# EAGLE design DreamPicoPortSchem (EAGLE 9.7.0)
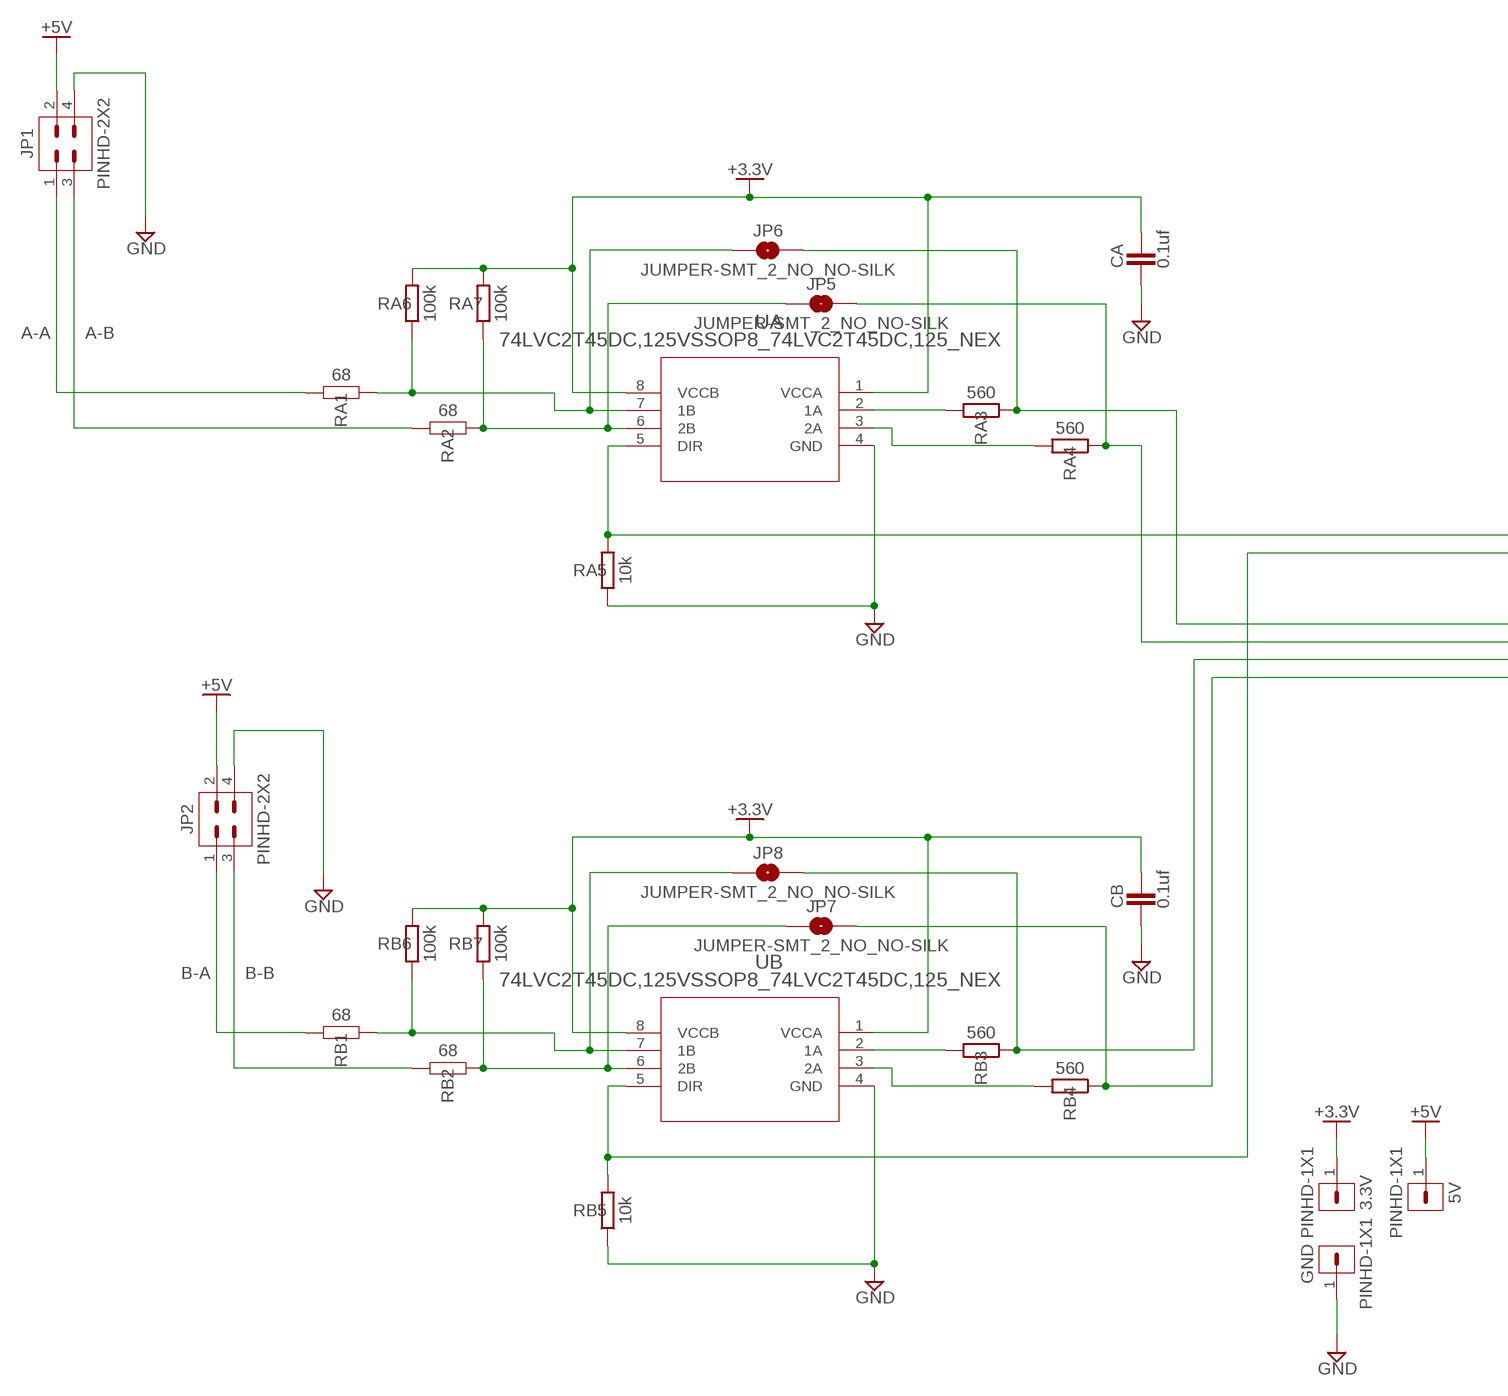
[diagram p0: schematic, sheet 1, part 1 of 2]
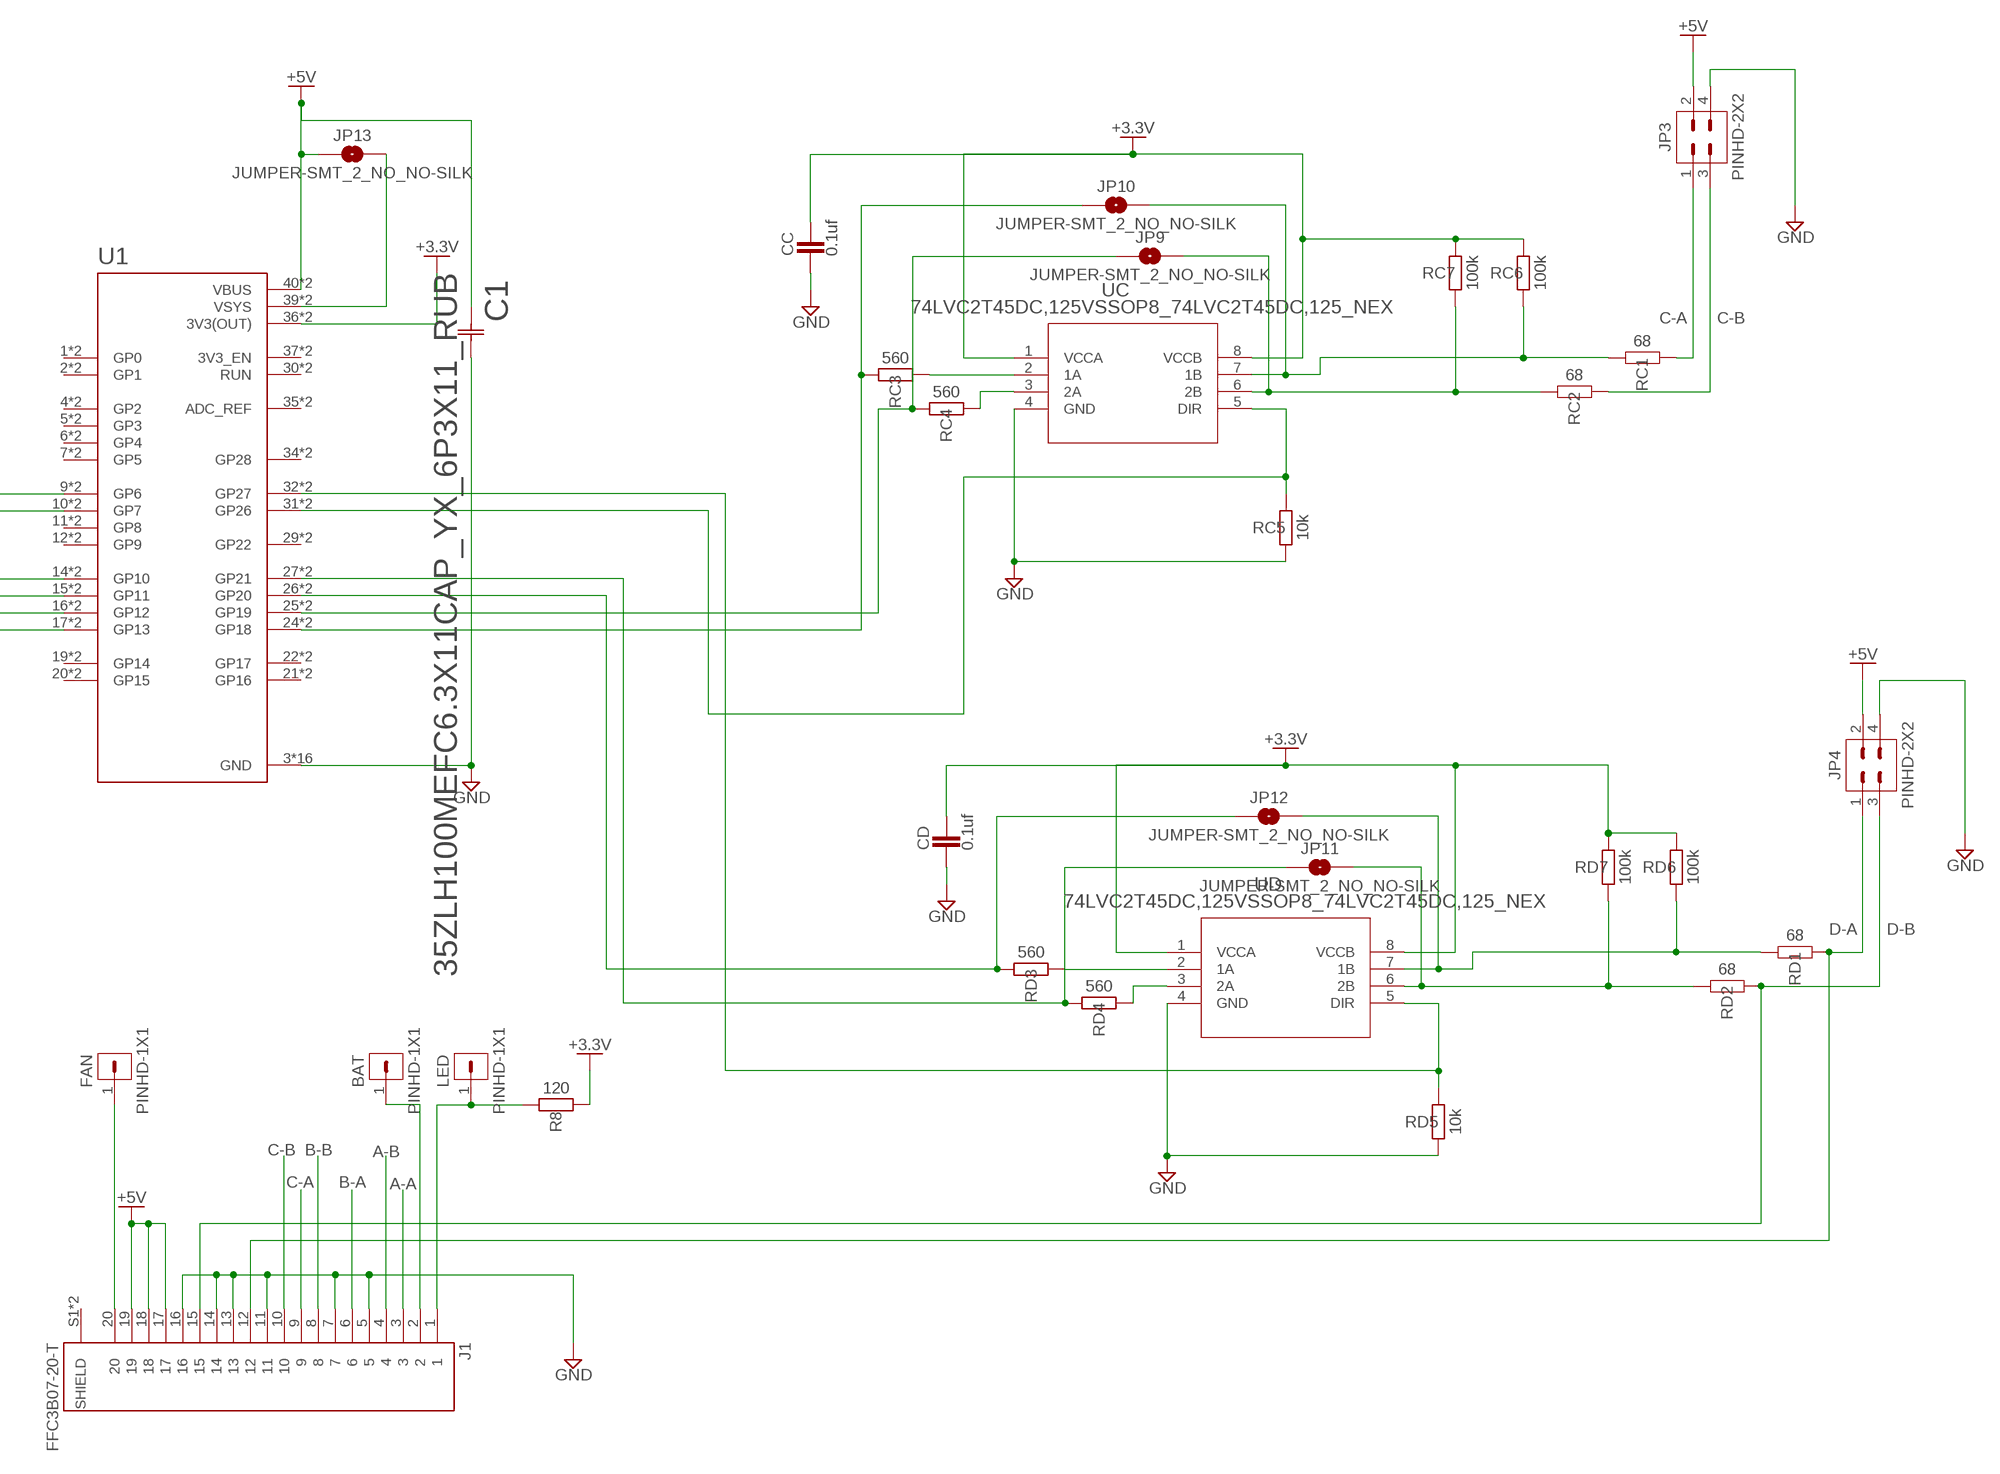
[diagram p1: schematic, sheet 1, part 2 of 2]

## Parts
3.3V  PINHD-1X1  [1X01]
5V  PINHD-1X1  [1X01]
BAT  PINHD-1X1  [1X01]
C1  35ZLH100MEFC6.3X11CAP_YX_6P3X11_RUB  [CAP_YX_6P3X11_RUB]
CA  0.1uf  CAPACITOR_CHIP-0603(1608-METRIC)  [CAPC1608X85]
CB  0.1uf  CAPACITOR_CHIP-0603(1608-METRIC)  [CAPC1608X85]
CC  0.1uf  CAPACITOR_CHIP-0603(1608-METRIC)  [CAPC1608X85]
CD  0.1uf  CAPACITOR_CHIP-0603(1608-METRIC)  [CAPC1608X85]
FAN  PINHD-1X1  [1X01]
GND  PINHD-1X1  [1X01]
J1  FFC3B07-20-T  [GCT_FFC3B07-20-T]
JP1  PINHD-2X2  [2X02]
JP2  PINHD-2X2  [2X02]
JP3  PINHD-2X2  [2X02]
JP4  PINHD-2X2  [2X02]
JP5  JUMPER-SMT_2_NO_NO-SILK  [SMT-JUMPER_2_NO_NO-SILK]
JP6  JUMPER-SMT_2_NO_NO-SILK  [SMT-JUMPER_2_NO_NO-SILK]
JP7  JUMPER-SMT_2_NO_NO-SILK  [SMT-JUMPER_2_NO_NO-SILK]
JP8  JUMPER-SMT_2_NO_NO-SILK  [SMT-JUMPER_2_NO_NO-SILK]
JP9  JUMPER-SMT_2_NO_NO-SILK  [SMT-JUMPER_2_NO_NO-SILK]
JP10  JUMPER-SMT_2_NO_NO-SILK  [SMT-JUMPER_2_NO_NO-SILK]
JP11  JUMPER-SMT_2_NO_NO-SILK  [SMT-JUMPER_2_NO_NO-SILK]
JP12  JUMPER-SMT_2_NO_NO-SILK  [SMT-JUMPER_2_NO_NO-SILK]
JP13  JUMPER-SMT_2_NO_NO-SILK  [SMT-JUMPER_2_NO_NO-SILK]
LED  PINHD-1X1  [1X01]
R8  120  RESISTOR__CHIP-0603(1608-METRIC)  [RESC1608X60]
RA1  68  R_CHIP-1206(3216-METRIC)  [RESC3216X70]
RA2  68  R_CHIP-1206(3216-METRIC)  [RESC3216X70]
RA3  560  RESISTOR__CHIP-0603(1608-METRIC)  [RESC1608X60]
RA4  560  RESISTOR__CHIP-0603(1608-METRIC)  [RESC1608X60]
RA5  10k  RESISTOR__CHIP-0603(1608-METRIC)  [RESC1608X60]
RA6  100k  RESISTOR__CHIP-0603(1608-METRIC)  [RESC1608X60]
RA7  100k  RESISTOR__CHIP-0603(1608-METRIC)  [RESC1608X60]
RB1  68  R_CHIP-1206(3216-METRIC)  [RESC3216X70]
RB2  68  R_CHIP-1206(3216-METRIC)  [RESC3216X70]
RB3  560  RESISTOR__CHIP-0603(1608-METRIC)  [RESC1608X60]
RB4  560  RESISTOR__CHIP-0603(1608-METRIC)  [RESC1608X60]
RB5  10k  RESISTOR__CHIP-0603(1608-METRIC)  [RESC1608X60]
RB6  100k  RESISTOR__CHIP-0603(1608-METRIC)  [RESC1608X60]
RB7  100k  RESISTOR__CHIP-0603(1608-METRIC)  [RESC1608X60]
RC1  68  R_CHIP-1206(3216-METRIC)  [RESC3216X70]
RC2  68  R_CHIP-1206(3216-METRIC)  [RESC3216X70]
RC3  560  RESISTOR__CHIP-0603(1608-METRIC)  [RESC1608X60]
RC4  560  RESISTOR__CHIP-0603(1608-METRIC)  [RESC1608X60]
RC5  10k  RESISTOR__CHIP-0603(1608-METRIC)  [RESC1608X60]
RC6  100k  RESISTOR__CHIP-0603(1608-METRIC)  [RESC1608X60]
RC7  100k  RESISTOR__CHIP-0603(1608-METRIC)  [RESC1608X60]
RD1  68  R_CHIP-1206(3216-METRIC)  [RESC3216X70]
RD2  68  R_CHIP-1206(3216-METRIC)  [RESC3216X70]
RD3  560  RESISTOR__CHIP-0603(1608-METRIC)  [RESC1608X60]
RD4  560  RESISTOR__CHIP-0603(1608-METRIC)  [RESC1608X60]
RD5  10k  RESISTOR__CHIP-0603(1608-METRIC)  [RESC1608X60]
RD6  100k  RESISTOR__CHIP-0603(1608-METRIC)  [RESC1608X60]
RD7  100k  RESISTOR__CHIP-0603(1608-METRIC)  [RESC1608X60]
U1  RASPBERRY_PICO-NO_DEBUG  [PICO-PKG-NO_DEBUG]
UA  74LVC2T45DC,125VSSOP8_74LVC2T45DC,125_NEX  [VSSOP8_74LVC2T45DC,125_NEX]
UB  74LVC2T45DC,125VSSOP8_74LVC2T45DC,125_NEX  [VSSOP8_74LVC2T45DC,125_NEX]
UC  74LVC2T45DC,125VSSOP8_74LVC2T45DC,125_NEX  [VSSOP8_74LVC2T45DC,125_NEX]
UD  74LVC2T45DC,125VSSOP8_74LVC2T45DC,125_NEX  [VSSOP8_74LVC2T45DC,125_NEX]

## Nets
+3.3V: 3.3V.1 CA.1 CB.1 CC.1 CD.1 R8.1 RA6.2 RA7.2 RB6.2 RB7.2 RC6.2 RC7.2 RD6.2 RD7.2 U1.36(3V3(OUT)) U1.P$36(3V3(OUT)) UA.1(VCCA) UA.8(VCCB) UB.1(VCCA) UB.8(VCCB) UC.1(VCCA) UC.8(VCCB) UD.1(VCCA) UD.8(VCCB)
+5V: 5V.1 C1.1 J1.17 J1.18 J1.19 JP1.2 JP2.2 JP3.2 JP4.2 JP13.1 U1.40(VBUS) U1.P$40(VBUS)
A-A: J1.3 JP1.1 RA1.1
A-B: J1.4 JP1.3 RA2.1
B-A: J1.6 JP2.1 RB1.1
B-B: J1.8 JP2.3 RB2.1
C-A: J1.9 JP3.1 RC1.2
C-B: J1.10 JP3.3 RC2.2
D-A: J1.12 JP4.1 RD1.2
D-B: J1.15 JP4.3 RD2.2
GND: C1.2 CA.2 CB.2 CC.2 CD.2 GND.1 J1.5 J1.7 J1.11 J1.13 J1.14 J1.16 JP1.4 JP2.4 JP3.4 JP4.4 RA5.1 RB5.1 RC5.1 RD5.1 U1.3(GND) U1.8(GND) U1.13(GND) U1.18(GND) U1.23(GND) U1.28(GND) U1.33(GND) U1.38(GND) U1.P$3(GND) U1.P$8(GND) U1.P$13(GND) U1.P$18(GND) U1.P$23(GND) U1.P$28(GND) U1.P$33(GND) U1.P$38(GND) UA.4(GND) UB.4(GND) UC.4(GND) UD.4(GND)
N$1: RA5.2 U1.9(GP6) U1.P$9(GP6) UA.5(DIR)
N$2: RD3.1 UD.2(1A)
N$3: JP6.2 RA3.1 U1.14(GP10) U1.P$14(GP10)
N$4: RB3.2 UB.2(1A)
N$5: RA4.2 UA.3(2A)
N$6: JP5.1 RA2.2 RA7.1 UA.6(2B)
N$7: JP6.1 RA1.2 RA6.1 UA.7(1B)
N$8: RC5.2 U1.31(GP26) U1.P$31(GP26) UC.5(DIR)
N$9: FAN.1 J1.20
N$10: BAT.1 J1.2
N$11: JP10.1 RC3.2 U1.24(GP18) U1.P$24(GP18)
N$12: RB5.2 U1.10(GP7) U1.P$10(GP7) UB.5(DIR)
N$13: JP8.2 RB3.1 U1.16(GP12) U1.P$16(GP12)
N$14: RD4.1 UD.3(2A)
N$15: JP7.2 RB4.1 U1.17(GP13) U1.P$17(GP13)
N$16: RB4.2 UB.3(2A)
N$17: J1.1 LED.1 R8.2
N$18: JP8.1 RB1.2 RB6.1 UB.7(1B)
N$19: JP7.1 RB2.2 RB7.1 UB.6(2B)
N$20: RA3.2 UA.2(1A)
N$21: JP5.2 RA4.1 U1.15(GP11) U1.P$15(GP11)
N$22: JP9.1 RC4.2 U1.25(GP19) U1.P$25(GP19)
N$23: RC4.1 UC.3(2A)
N$24: JP13.2 U1.39(VSYS) U1.P$39(VSYS)
N$25: JP10.2 RC1.1 RC6.1 UC.7(1B)
N$26: JP9.2 RC2.1 RC7.1 UC.6(2B)
N$27: RC3.1 UC.2(1A)
N$29: JP12.1 RD3.2 U1.26(GP20) U1.P$26(GP20)
N$30: JP11.1 RD4.2 U1.27(GP21) U1.P$27(GP21)
N$33: RD5.2 U1.32(GP27) U1.P$32(GP27) UD.5(DIR)
N$36: JP12.2 RD1.1 RD6.1 UD.7(1B)
N$37: JP11.2 RD2.1 RD7.1 UD.6(2B)
Unconnected: J1.S1(SHIELD) J1.S2(SHIELD) U1.1(GP0) U1.2(GP1) U1.4(GP2) U1.5(GP3) U1.6(GP4) U1.7(GP5) U1.11(GP8) U1.12(GP9) U1.19(GP14) U1.20(GP15) U1.21(GP16) U1.22(GP17) U1.29(GP22) U1.30(RUN) U1.34(GP28) U1.35(ADC_REF) U1.37(3V3_EN) U1.P$1(GP0) U1.P$2(GP1) U1.P$4(GP2) U1.P$5(GP3) U1.P$6(GP4) U1.P$7(GP5) U1.P$11(GP8) U1.P$12(GP9) U1.P$19(GP14) U1.P$20(GP15) U1.P$21(GP16) U1.P$22(GP17) U1.P$29(GP22) U1.P$30(RUN) U1.P$34(GP28) U1.P$35(ADC_REF) U1.P$37(3V3_EN)

## Library data of the parts
3.3V 5V BAT FAN GND LED = Connector:PINHD-1X1: Pin Header; CATEGORY: Connectors; DESCRIPTION: Header-Straight-1 Position; PACKAGE_TYPE: Through Hole; PITCH: 0.100" (2.54mm); SUBCATEGORY: Headers; TYPE: Male Pins
C1 = 2025-03-29_20-35-50_Library:35ZLH100MEFC6.3X11; COPYRIGHT: Copyright (C) 2025 Ultra Librarian. All rights reserved.; MANUFACTURER_PART_NUMBER: 35ZLH100MEFC6.3X11; MFR_NAME: Rubycon
CA CB CC CD = Tinkercad:CAPACITOR: Capacitor - Generic; CATEGORY: Capacitor
J1 = FFC3B07-20-T:FFC3B07-20-T; MANUFACTURER: GCT; MAXIMUM_PACKAGE_HEIGHT: 2.5mm; PARTREV: A; STANDARD: Manufacturer Recommendations
JP1-JP4 = 6-pin-connector:PINHD-2X2: Pin Header; CATEGORY: Connectors; DESCRIPTION: Header-Straight-2x2 Position; PACKAGE_TYPE: Through Hole; PITCH: 0.100" (2.54mm); SUBCATEGORY: Headers; TYPE: Male Pins
JP5-JP13 = SparkFun-Jumpers:JUMPER-SMT_2_NO: Normally open jumper This jumper has two pads in close proximity to each other. Apply solder to close the connection. Round pads are easier to solder for beginners, but are a lot larger. SparkFun Product that uses the round pads: SparkFun EL Sequencer <https://www.sparkfun.com/products/12781>
R8 RA3 RA5-RA7 RB3 RB5-RB7 RC3-RC7 RD3-RD7 = Tinkercad:RESISTOR: Resistor Fixed - Generic; CATEGORY: Resistor; SUB-CATEGORY: Fixed
RA1 RA2 RB1 RB2 RC1 RC2 RD1 RD2 = Resistor:R: Resistor Fixed - Generic; CATEGORY: Resistors; DESCRIPTION: Chip Resistor 3.20 X 1.60 X 0.70 mm body 1206(3216-METRIC) Package; PACKAGE_SIZE: 1206; PACKAGE_TYPE: SMD
RA4 RB4 = Tinkercad:RESISTOR: Resistor Fixed - Generic; CATEGORY: Resistor; RATING: 4; SUB-CATEGORY: Fixed
U1 = RpiPico-jms:RASPBERRY_PICO-NO_DEBUG
UA UB UC UD = 2025-03-28_15-27-25_Library:74LVC2T45DC,125; COPYRIGHT: Copyright (C) 2025 Ultra Librarian. All rights reserved.; MANUFACTURER_PART_NUMBER: 74LVC2T45DC,125; MFR_NAME: Nexperia

## Board
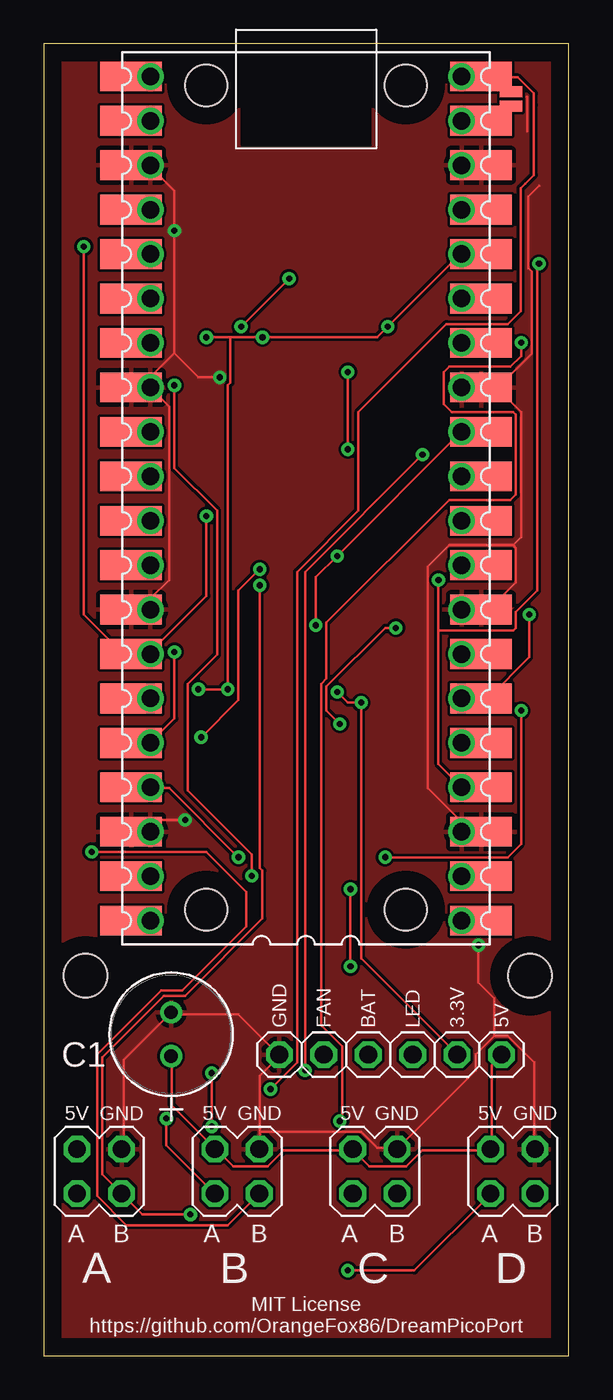
[diagram p2: board, top side]
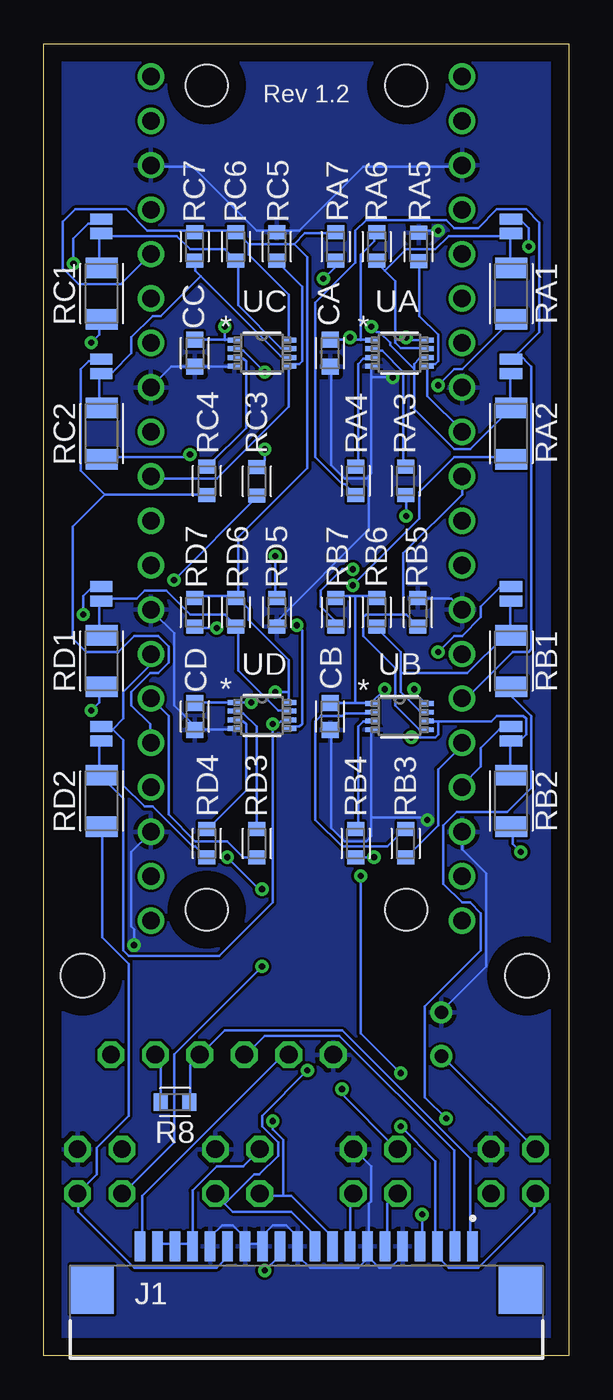
[diagram p3: board, bottom side, seen from below]

Size 30 x 75 mm. Coordinates in mm from the lower left corner, seen from the top.
Outline: 0,0 30,0 30,75 0,75 0,0
Copper layers (1*16): Top 0.035mm / dielectric 1.5mm / Bottom 0.035mm
Design rules "Fusion Electronics Design Rules *": minimum track width 6mil, minimum drill 0.35mm, track to track 6mil, track to pad 6mil, pad to pad 6mil, via to via 6mil, smd to smd 6mil, copper to edge 40mil, drill to drill 6mil, minimum pad ring 10mil, minimum via ring 8mil, stop-mask expansion 4mil, vias tented up to drill 0.4mm, thermal gap 10mil
Holes 2.5 mm at 27.78,21.72 2.38,21.72

### Footprints (pad centres in the part's own frame; a part is rotated, then mirrored left to right if it is on the bottom)
1X01 = drill 1.016 octagon: 1 0,0
CAP_YX_6P3X11_RUB = drill 0.762 pad 1.27: 1 0,0; 2 2.5,0
CAPC1608X85 = smd 0.921 x 0.97: 1 -0.775,0; 2 0.775,0
GCT_FFC3B07-20-T = smd 0.6 x 1.7: 1 9.5,2.45; 2 8.5,2.45; 3 7.5,2.45; 4 6.5,2.45; 5 5.5,2.45; 6 4.5,2.45; 7 3.5,2.45; 8 2.5,2.45; 9 1.5,2.45; 10 0.5,2.45; 11 -0.5,2.45; 12 -1.5,2.45; 13 -2.5,2.45; 14 -3.5,2.45; 15 -4.5,2.45; 16 -5.5,2.45; 17 -6.5,2.45; 18 -7.5,2.45; 19 -8.5,2.45; 20 -9.5,2.45 | smd 2.5 x 2.8: S1 12.25,0; S2 -12.25,0
2X02 = drill 1.016 octagon: 1 -1.27,-1.27; 2 -1.27,1.27; 3 1.27,-1.27; 4 1.27,1.27
SMT-JUMPER_2_NO_NO-SILK = smd 0.635 x 1.27: 1 -0.406,0; 2 0.406,0
RESC1608X60 = smd 0.799 x 0.974: 1 -0.815,0; 2 0.815,0
RESC3216X70 = smd 1.165 x 1.815: 1 -1.475,0; 2 1.475,0
PICO-PKG-NO_DEBUG = drill 1: 1 -7.62,25.4; 2 -7.62,22.86; 3 -7.62,20.32; 4 -7.62,17.78; 5 -7.62,15.24; 6 -7.62,12.7; 7 -7.62,10.16; 8 -7.62,7.62; 9 -7.62,5.08; 10 -7.62,2.54; 11 -7.62,0; 12 -7.62,-2.54; 13 -7.62,-5.08; 14 -7.62,-7.62; 15 -7.62,-10.16; 16 -7.62,-12.7; 17 -7.62,-15.24; 18 -7.62,-17.78; 19 -7.62,-20.32; 20 -7.62,-22.86; 21 10.16,-22.86; 22 10.16,-20.32; 23 10.16,-17.78; 24 10.16,-15.24; 25 10.16,-12.7; 26 10.16,-10.16; 27 10.16,-7.62; 28 10.16,-5.08; 29 10.16,-2.54; 30 10.16,0; 31 10.16,2.54; 32 10.16,5.08; 33 10.16,7.62; 34 10.16,10.16; 35 10.16,12.7; 36 10.16,15.24; 37 10.16,17.78; 38 10.16,20.32; 39 10.16,22.86; 40 10.16,25.4 | smd 3.5 x 1.7: P$1 -8.73,25.4; P$2 -8.73,22.86; P$3 -8.73,20.32; P$4 -8.73,17.78; P$5 -8.73,15.24; P$6 -8.73,12.7; P$7 -8.73,10.16; P$8 -8.73,7.62; P$9 -8.73,5.08; P$10 -8.73,2.54; P$11 -8.73,0; P$12 -8.73,-2.54; P$13 -8.73,-5.08; P$14 -8.73,-7.62; P$15 -8.73,-10.16; P$16 -8.73,-12.7; P$17 -8.73,-15.24; P$18 -8.73,-17.78; P$19 -8.73,-20.32; P$20 -8.73,-22.86; P$21 11.27,-22.86; P$22 11.27,-20.32; P$23 11.27,-17.78; P$24 11.27,-15.24; P$25 11.27,-12.7; P$26 11.27,-10.16; P$27 11.27,-7.62; P$28 11.27,-5.08; P$29 11.27,-2.54; P$30 11.27,0; P$31 11.27,2.54; P$32 11.27,5.08; P$33 11.27,7.62; P$34 11.27,10.16; P$35 11.27,12.7; P$36 11.27,15.24; P$37 11.27,17.78; P$38 11.27,20.32; P$39 11.27,22.86; P$40 11.27,25.4 | hole 2.4: 6.97,24.877; -4.43,24.877; 6.971,-22.237; -4.43,-22.237
VSSOP8_74LVC2T45DC,125_NEX = smd 0.762 x 0.279: 1 -1.575,0.75; 2 -1.575,0.25; 3 -1.575,-0.25; 4 -1.575,-0.75; 5 1.575,-0.75; 6 1.575,-0.25; 7 1.575,0.25; 8 1.575,0.75

### Placement (x,y rotation side)
3.3V  23.62,17.21 0 top
5V  26.16,17.21 0 top
BAT  18.54,17.21 0 top
C1  7.28,17.13 90 top
CA  13.64,57.32 270 bottom
CB  13.64,36.54 270 bottom
CC  21.36,57.32 270 bottom
CD  21.36,36.54 270 bottom
FAN  16,17.21 0 top
GND  13.46,17.21 0 top
J1  15,3.81 0 bottom
JP1  3.17,10.54 0 top
JP2  11.05,10.54 0 top
JP3  18.92,10.54 0 top
JP4  26.8,10.54 0 top
JP5  3.31,56.56 90 bottom
JP6  3.31,64.57 90 bottom
JP7  3.31,35.56 90 bottom
JP8  3.31,43.56 90 bottom
JP9  26.72,56.56 270 bottom
JP10  26.72,64.57 270 bottom
JP11  26.72,35.56 270 bottom
JP12  26.72,43.56 270 bottom
JP13  26.7,71.84 270 top
LED  21.08,17.21 0 top
R8  22.5,14.5 0 bottom
RA1  3.29,60.72 90 bottom
RA2  3.29,52.72 90 bottom
RA3  9.32,50.01 90 bottom
RA4  12.18,50.01 90 bottom
RA5  8.58,63.4 270 bottom
RA6  10.97,63.41 90 bottom
RA7  13.32,63.41 90 bottom
RB1  3.29,39.72 90 bottom
RB2  3.29,31.72 90 bottom
RB3  9.32,29.29 90 bottom
RB4  12.18,29.29 90 bottom
RB5  8.62,42.51 270 bottom
RB6  10.97,42.51 90 bottom
RB7  13.32,42.51 90 bottom
RC1  26.69,60.72 270 bottom
RC2  26.69,52.72 270 bottom
RC3  17.82,49.99 270 bottom
RC4  20.68,50.01 270 bottom
RC5  16.68,63.41 270 bottom
RC6  19.03,63.41 90 bottom
RC7  21.38,63.41 90 bottom
RD1  26.69,39.72 270 bottom
RD2  26.69,31.72 270 bottom
RD3  17.82,29.29 270 bottom
RD4  20.68,29.29 270 bottom
RD5  16.68,42.51 90 bottom
RD6  19.03,42.51 90 bottom
RD7  21.38,42.51 90 bottom
U1  13.72,47.73 0 top
UA  9.67,57.32 0 bottom
UB  9.67,36.54 0 bottom
UC  17.53,57.32 0 bottom
UD  17.53,36.6 0 bottom

### Tracks (layer width: path | path; a pad name or v marks a point on that pad's centre or on a via)
+3.3V  (via drill 0.35)
  Top 0.152: v8.84,38.1 v10.52,38.1 10.52,55.47 10.67,55.63 10.67,58.22 | 10.67,58.22 v12.5,58.22 19.05,58.22 v19.66,58.83 23.77,62.94 U1.P$36 23.93,62.94 U1.36 | 10.67,58.22 v9.3,58.22 | 3.3V.1 18.14,22.71 v18.14,37.34 17.37,37.34 v16.76,37.95
  Bottom 0.152: CC.1 19.66,58.09 | 19.66,58.09 19.12,58.09 UC.1 | CA.1 12.5,58.09 | 12.5,58.09 11.89,58.09 | 11.89,58.09 11.27,58.09 UA.1 | CD.1 21.33,37.35 UD.1 19.05,37.34 v18.14,37.34 | CB.1 12.19,37.31 | 12.19,37.31 11.27,37.31 UB.1 11.28,37.34 v10.52,38.1 | 12.19,43.43 13.26,43.43 RB7.2 | 12.19,43.43 11.12,43.43 RB6.2 | v8.84,38.1 8.84,37.95 8.23,37.34 UB.8 | 12.19,43.43 12.19,37.34 12.19,37.31 | 11.89,58.09 11.89,58.06 11.89,58.09 | 11.89,58.09 11.89,62.94 11.12,63.7 11.12,64.16 RA6.2 | v9.3,58.22 9.14,58.06 8.23,58.06 UA.8 | v19.66,58.83 19.66,58.09 | 19.66,58.09 19.66,58.06 19.66,58.09 | v12.5,58.22 12.5,58.09 | 12.5,58.09 12.5,58.06 12.5,58.09 | R8.1 23.32,14.63 23.32,16.76 23.62,17.07 3.3V.1 | 16,37.95 16,39.78 18.29,42.06 18.29,42.67 18.9,43.28 RD6.2 | 16,37.95 16,37.34 UD.8 | RD7.2 21.34,43.43 19.05,43.43 RD6.2 | 18.29,63.55 18.29,62.94 16,60.66 16,58.06 UC.8 | 18.29,63.55 18.9,64.16 RC6.2 19.05,64.31 21.34,64.31 RC7.2 21.49,64.31 24.08,64.31 25.3,65.53 28.19,65.53 28.91,64.82 28.91,62.17 28,61.27 25.6,61.27 23.93,62.94 U1.36 | 15.7,63.55 15.09,64.16 13.41,64.16 RA7.2 | 18.29,63.55 15.7,63.55 | 15.7,63.55 14.94,62.79 14.94,50.75 18.9,46.79 18.9,43.43 RD6.2 | 16,37.95 v16.76,37.95
+5V  (via drill 0.35)
  Top 0.152: 5V.1 26.06,17.07 25.6,16.61 25.6,11.89 JP4.2 25.45,11.73 21.64,11.73 20.73,10.82 18.59,10.82 17.68,11.73 JP3.2 17.53,11.73 13.72,11.73 12.8,10.82 10.82,10.82 9.91,11.73 JP2.2 9.75,11.89 7.32,14.33 7.32,17 | 7.32,17 7.32,17.07 | v12.95,15.24 14.48,16.76 14.48,44.81 17.98,48.31 17.98,53.95 23.01,58.98 26.52,58.98 27.25,59.71 27.25,59.75 27.25,64 27.25,66.75 27.5,67 28,67.5 28,71.5 28,72.16 27.08,73.08 24.49,73.08 | JP13.1 25.81,73.13 25.5,73.13 U1.P$40 | C1.1 7.25,17 7.32,17 | 24.75,73.25 U1.P$40 | 24.75,73.25 24,73.25 U1.40 | 24.75,73.25 U1.P$40 | 23.75,73 24,73.03 24.49,73.08 | 24.49,73.08 U1.P$40
  Bottom 0.152: J1.19 23.47,6.4 22.55,6.4 J1.18 22.4,6.4 21.64,6.4 J1.17 21.49,6.4 21.49,9.45 20.12,10.82 18.59,10.82 17.68,11.73 JP3.2 | 7.16,17.07 7.05,16.95 | 7.05,16.95 1.98,11.89 JP1.2 | v12.95,15.24 12.95,14.94 9.91,11.89 JP2.2 | C1.1 7.25,17 7,17 7.05,16.95
A-A  (via drill 0.35)
  Top 0.152: v7.47,55.47 7.47,50.75 9.91,48.31 9.91,40.08 8.23,38.41 8.23,32.31 11.89,28.65 v11.89,27.43 | v9.6,13.11 v9.6,16.15
  Bottom 0.152: JP1.1 1.98,9.14 1.98,8.23 5.18,5.03 6.86,5.03 7.47,5.64 7.47,6.25 J1.3 7.62,6.4 7.62,11.12 v9.6,13.11 | v7.47,55.47 6.55,56.39 6.1,56.39 3.35,59.13 RA1.1 | v11.89,27.43 11.89,18.44 v9.6,16.15
A-B  (via drill 0.35)
  Top 0.152: v8.38,8.08 5.64,8.08 4.57,9.14 JP1.3 4.42,9.3 3.35,10.36 3.35,17.07 6.86,20.57 8.08,20.57 12.5,24.99 12.5,27.74 12.34,27.89 v12.34,44.04
  Bottom 0.152: v8.38,8.08 8.38,6.4 J1.4 | v12.34,44.04 8.53,47.85 8.53,49.38 6.55,51.36 3.35,51.36 RA2.1
B-A  (via drill 0.35)
  Top 0.152: v7.01,13.56 7.01,12.04 9.75,9.3 JP2.1
  Bottom 0.152: J1.6 10.36,6.4 10.36,8.69 9.91,9.14 JP2.1 | v7.01,13.56 8.23,14.78 8.23,19.96 5.03,23.16 5.03,25.3 5.64,25.91 6.1,25.91 7.16,26.98 7.16,30.33 6.4,31.09 3.5,31.09 2.13,32.46 2.13,36.58 3.2,37.64 3.2,38.1 RB1.1
B-B  (via drill 0.35)
  Top 0.152: v2.74,28.8 9.3,28.8 11.58,26.52 11.58,24.54 7.92,20.88 6.71,20.88 3.05,17.22 3.05,9.14 4.72,7.47 10.52,7.47 12.19,9.14 JP2.3
  Bottom 0.152: J1.8 12.5,6.4 12.5,8.99 12.34,9.14 JP2.3 | v2.74,28.8 3.2,29.26 3.2,30.18 RB2.1
C-A  (via drill 0.35)
  Top 0.152: v27.28,57.91 27.28,57.15 26.67,56.54 23.16,56.54 22.86,56.24 22.86,54.41 23.32,53.95 26.82,53.95 26.98,53.8 26.98,49.23 26.67,48.92 23.16,48.92 16.15,41.91 16.15,38.71 15.85,38.41 15.85,18.9 17.07,17.68 17.07,13.56 v16.92,13.41
  Bottom 0.152: 16.31,9.14 17.53,9.14 JP3.1 | 16.31,9.14 15.85,9.14 13.56,6.86 13.56,6.4 J1.9 | v27.28,57.91 26.82,58.37 26.82,59.13 RC1.2 | v16.92,13.41 16.92,12.95 16.31,12.34 16.31,9.14
C-B  (via drill 0.35)
  Top 0.152: v21.64,51.51 14.94,44.81 v14.94,16.31
  Bottom 0.152: 19.66,8.69 20.12,9.14 JP3.3 | 19.66,8.69 19.2,8.23 15.85,8.23 14.63,7.01 14.63,6.4 J1.10 | v21.64,51.51 21.79,51.36 26.67,51.36 RC2.2 | v14.94,16.31 17.53,13.72 17.53,13.11 16.61,12.19 16.61,11.43 17.68,10.36 17.98,10.36 19.66,8.69
D-A  (via drill 0.35)
  Top 0.152: v17.37,4.88 21.18,4.88 25.45,9.14 JP4.1 | v27.28,36.88 27.28,29.26 26.52,28.5 v19.51,28.5 | v17.53,22.25 v17.53,26.67
  Bottom 0.152: v17.37,4.88 16.61,5.64 16.61,6.25 J1.12 | v27.28,36.88 26.82,37.34 26.82,38.1 RD1.2 | v19.51,28.5 17.68,26.67 v17.53,26.67 | v17.53,22.25 22.55,17.22 22.55,12.19 25.45,9.3 JP4.1
D-B
  Bottom 0.152: J1.15 19.51,6.25 19.51,5.64 20.12,5.03 24.84,5.03 28.04,8.23 28.04,9.14 JP4.3 28.04,9.3 26.98,10.36 26.98,11.89 25.15,13.72 25.15,22.4 26.67,23.93 26.67,30.18 RD2.2
GND  (via drill 0.35)
  Top 0.152: 6.1,30.02 5.03,30.02 U1.P$18 | 6.1,30.02 U1.18 6.1,30.02 | v8.08,30.63 6.71,30.63 6.1,30.02 | JP1.4 4.57,11.89 4.57,16.92 7.16,19.51 C1.2 7.32,19.51 11.12,19.51 13.41,17.22 GND.1 13.41,17.07 12.34,16 12.34,12.8 | 12.34,12.8 12.34,11.89 JP2.4 | 12.34,12.8 18.14,12.8 19.05,11.89 20.12,11.89 JP3.4 20.27,11.89 24.69,16.31 24.69,17.22 25.76,18.29 | 25.76,18.29 26.52,18.29 28.04,16.76 28.04,11.89 JP4.4 | U1.P$33 24.84,55.47 23.93,55.47 U1.33 | U1.P$23 24.84,30.02 23.93,30.02 U1.23 23.77,30.02 23.77,30.63 21.95,32.46 21.95,45.11 23.16,46.33 26.82,46.33 | U1.28 23.93,42.67 24.84,42.67 U1.P$28 24.99,42.67 25.45,42.67 26.98,44.2 26.98,46.18 26.82,46.33 | 25.91,55.32 24.99,55.32 U1.P$33 | 25.91,55.32 27.28,53.95 27.28,46.79 26.82,46.33 | U1.38 23.93,68.12 24.84,68.12 U1.P$38 24.99,67.97 25.6,67.97 | 6.1,42.67 5.03,42.67 U1.P$13 | 6.1,42.67 U1.13 6.1,42.67 | 6.1,55.32 5.03,55.32 U1.P$8 | 6.1,55.32 U1.8 | 6.1,67.97 7.47,66.6 v7.47,64.31 7.47,57.3 | 6.1,67.97 U1.P$3 6.1,67.97 | 6.1,67.97 U1.3 | 7.47,57.3 6.1,55.93 6.1,55.47 U1.8 | 6.1,42.67 6.1,43.28 7.16,44.35 7.16,54.25 6.1,55.32 | 6.1,55.32 U1.8 | v10.06,55.93 8.84,55.93 7.47,57.3 | 25.91,55.32 U1.P$33 | 25.76,18.29 25.76,20.42 24.84,21.34 v24.84,23.47 | 25.91,55.32 27.89,57.3 27.89,61.98 27.69,62.17 27.69,66.26 28.3,66.87 | 27.63,69.99 27.63,71.94 27.59,71.98
  Bottom 0.152: 11.28,30.79 11.28,29.72 11.58,29.41 12.8,29.41 13.56,30.18 13.56,35.66 CB.2 | 11.28,30.79 11.28,35.66 UB.4 | 11.28,30.79 8.23,30.79 v8.08,30.63 | 11.43,5.64 10.82,5.03 10.21,5.03 9.6,5.64 9.6,6.25 J1.5 | 11.43,5.64 11.43,6.25 J1.7 | J1.16 20.42,6.4 20.42,6.86 19.81,7.47 19.2,7.47 18.59,6.86 18.59,6.4 J1.14 18.44,6.4 17.53,6.4 J1.13 17.37,6.4 17.37,7.01 16.92,7.47 16.15,7.47 15.54,6.86 15.54,6.4 J1.11 15.39,6.25 15.39,5.64 14.78,5.03 12.04,5.03 11.43,5.64 | 11.43,5.64 J1.7 | J1.7 11.43,6.4 11.43,8.69 11.28,8.84 11.28,10.82 12.19,11.73 JP2.4 | U1.18 6.1,29.87 6.1,28.96 4.72,27.58 4.72,22.25 7.32,19.66 C1.2 | UC.4 19.2,56.54 21.34,56.54 CC.2 21.49,56.54 22.71,56.54 23.77,55.47 U1.33 | UD.4 19.2,35.81 21.34,35.81 CD.2 21.49,35.81 21.49,36.12 22.55,37.19 22.55,41.3 23.77,42.52 U1.28 | 11.28,55.93 11.28,50.44 11.43,50.29 | 11.28,55.93 11.28,56.54 UA.4 | 11.43,50.29 11.58,50.14 12.8,50.14 13.56,50.9 13.56,56.54 CA.2 | 11.43,50.29 11.43,47.24 16.61,42.06 16.61,41.76 RD5.1 | U1.38 23.77,67.97 21.49,67.97 17.83,64.31 16.76,64.31 RC5.1 16.61,64.31 15.39,64.31 11.73,67.97 6.1,67.97 U1.3 | RB5.1 8.53,43.28 6.71,43.28 6.1,42.67 U1.13 | v7.47,64.31 8.53,64.31 RA5.1 | v10.06,55.93 11.28,55.93 | v24.84,23.47 24.84,24.38 24.99,24.54 24.99,28.8 23.93,29.87 U1.23
  pour Top: 0.46,0.06 0.48,0.08 29.92,0.08 29.92,74.92 0.08,74.92 0.08,-0.32
  pour Bottom: 0.08,0.08 29.92,0.08 29.92,74.92 0.08,74.92
N$1
  Top 0.152: U1.P$9 5.03,52.88 6.1,52.88 U1.9
  Bottom 0.152: U1.9 6.1,52.88 8.08,54.86 8.08,56.54 UA.5 8.08,56.69 7.62,56.69 7.47,56.84 7.47,58.37 8.53,59.44 8.53,62.48 RA5.2
N$2
  Bottom 0.152: UD.2 19.05,36.73 18.59,36.73 17.83,35.97 17.83,30.18 RD3.1
N$3  (via drill 0.35)
  Top 0.152: v9.3,48.01 9.3,43.43 6.1,40.23 | 6.1,40.23 U1.P$14 | v2.29,63.4 2.29,42.37 4.42,40.23 4.88,40.23 U1.P$14 | 6.1,40.23 U1.14 | 6.1,40.23 U1.P$14
  Bottom 0.152: v9.3,48.01 9.3,49.07 RA3.1 | v2.29,63.4 2.29,64.47 2.74,64.92 3.2,64.92 JP6.2
N$4
  Bottom 0.152: UB.2 11.28,36.73 12.8,36.73 12.95,36.58 14.17,36.58 14.48,36.27 14.48,30.63 12.95,29.11 10.36,29.11 9.45,30.02 RB3.2
N$5
  Bottom 0.152: UA.3 11.28,57 11.73,57 12.04,56.69 12.04,50.9 RA4.2
N$6  (via drill 0.35)
  Top 0.152: v11.28,58.83 v14.02,61.57
  Bottom 0.152: 8.84,56.39 8.84,54.1 6.55,51.82 5.64,51.82 3.35,54.1 RA2.2 3.35,54.25 3.35,56.08 JP5.1 | 8.84,56.39 8.84,56.69 8.53,57 8.23,57 UA.6 | v14.02,61.57 13.41,62.18 13.41,62.48 RA7.1 | v11.28,58.83 10.97,58.52 10.82,58.52 10.21,57.91 10.21,57.76 8.84,56.39
N$7
  Bottom 0.152: 3.35,64.01 3.35,62.33 RA1.2 | 3.35,64.01 JP6.1 3.35,64.01 | 10.52,62.03 10.97,62.48 RA6.1 | 10.52,62.03 9.91,61.42 9.91,57.91 9.6,57.61 8.23,57.61 UA.7 | 3.35,64.01 6.86,64.01 7.62,63.25 9.3,63.25 10.52,62.03
N$8
  Top 0.152: U1.31 23.93,50.29 24.84,50.29 U1.P$31
  Bottom 0.152: RC5.2 16.61,62.48 15.24,61.11 15.24,56.84 15.39,56.69 15.85,56.69 UC.5 16,56.54 16,54.25 20.12,50.14 23.77,50.14 U1.31
N$9
  Bottom 0.152: J1.20 24.38,6.4 24.38,9.14 16.46,17.07 16,17.07 FAN.1
N$10
  Bottom 0.152: J1.2 6.55,6.4 6.55,11.73 13.11,18.29 17.37,18.29 18.44,17.22 BAT.1
N$11  (via drill 0.35)
  Top 0.152: 22.55,41.45 22.55,33.83 23.77,32.61 U1.P$24 23.93,32.61 U1.24 | 22.55,41.45 v22.55,44.35 | 22.55,41.45 26.82,41.45 26.98,41.6 26.98,42.52 28.19,43.74 28.19,62.31 v28.3,62.42
  Bottom 0.152: v22.55,44.35 17.83,49.07 RC3.2 | JP10.1 26.99,64.71 27.45,64.71 28.3,63.86 v28.3,62.42
N$12
  Top 0.152: U1.10 6.1,50.29 5.03,50.29 U1.P$10
  Bottom 0.152: 9.45,42.37 9.3,42.37 8.69,41.76 RB5.2 | 9.45,42.37 11.58,42.37 11.73,42.22 11.73,41.15 9.91,39.32 9.91,37.19 8.53,35.81 8.23,35.81 UB.5 | 9.45,42.37 9.45,45.87 6.1,49.23 6.1,50.14 U1.10
N$13  (via drill 0.35)
  Top 0.152: v7.47,40.23 7.47,36.42 6.1,35.05 | 6.1,35.05 U1.P$16 6.1,35.05 | 6.1,35.05 U1.16
  Bottom 0.152: RB3.1 9.3,28.5 7.47,30.33 7.47,33.53 6.1,34.9 U1.16 | v7.47,40.23 6.55,41.15 6.1,41.15 5.03,42.22 5.03,42.82 3.96,43.89 3.35,43.89 JP8.2
N$14
  Bottom 0.152: UD.3 19.05,36.27 18.59,36.27 18.44,36.12 18.44,32.31 20.57,30.18 RD4.1
N$15  (via drill 0.35)
  Top 0.152: v11.12,28.5 7.16,32.46 6.1,32.46 | 6.1,32.46 U1.P$17 6.1,32.46 | 6.1,32.46 U1.17
  Bottom 0.152: JP7.2 3.35,35.81 3.96,35.81 5.03,34.75 5.03,33.68 6.1,32.61 U1.17 | v11.12,28.5 12.04,28.5 RB4.1
N$16
  Bottom 0.152: UB.3 11.28,36.27 11.73,36.27 12.04,35.97 12.04,30.18 RB4.2
N$17
  Bottom 0.152: R8.2 21.64,14.63 21.64,16.61 21.18,17.07 LED.1 21.03,17.22 19.66,18.59 12.95,18.59 5.64,11.28 5.64,6.4 J1.1
N$18
  Bottom 0.152: JP8.1 3.35,43.13 3.35,41.3 RB1.2 3.35,41.15 3.66,41.15 5.79,39.01 9.6,39.01 | 9.6,39.01 9.6,40.23 10.97,41.6 RB6.1 | 9.6,39.01 9.6,37.95 8.53,36.88 8.23,36.88 UB.7
N$19  (via drill 0.35)
  Top 0.152: v12.34,44.96 11.12,43.74 11.12,37.49 v8.99,35.36
  Bottom 0.152: 7.47,36.27 4.42,36.27 4.12,36.58 2.59,36.58 2.44,36.42 2.44,35.51 2.74,35.2 3.2,35.2 JP7.1 3.35,35.05 3.35,33.22 RB2.2 | 7.47,36.27 8.08,36.27 UB.6 | v12.34,44.96 12.95,44.96 14.17,43.74 14.17,42.82 13.41,42.06 13.41,41.76 RB7.1 | v8.99,35.36 7.62,35.36 7.47,35.51 7.47,36.27
N$20
  Bottom 0.152: UA.2 11.12,57.45 10.67,57.45 9.45,56.24 9.45,50.9 RA3.2
N$21
  Top 0.152: U1.15 6.1,37.64 5.03,37.64 U1.P$15
  Bottom 0.152: 2.9,57.3 3.2,57 JP5.2 | 2.9,57.3 1.68,58.52 1.68,64.77 2.44,65.53 4.12,65.53 5.18,64.47 6.55,64.47 7.01,64.92 11.58,64.92 12.19,64.31 12.19,62.48 14.48,60.2 14.48,51.36 12.95,49.84 12.8,49.84 12.19,49.23 RA4.1 | 2.9,57.3 2.13,56.54 2.13,40.39 2.29,40.23 3.2,40.23 5.79,37.64 6.1,37.64 U1.15
N$22
  Top 0.152: U1.25 23.93,35.05 24.84,35.05 U1.P$25
  Bottom 0.152: 26.52,49.23 20.73,49.23 RC4.2 | 26.52,49.23 27.89,50.6 27.89,56.39 27.43,56.84 26.82,56.84 JP9.1 | 26.52,49.23 28.35,47.4 28.35,41 27.58,40.23 25.76,40.23 24.84,41.15 23.47,41.15 22.86,40.54 22.86,39.62 23.47,39.01 23.93,39.01 24.99,37.95 24.99,37.19 23.93,36.12 23.93,35.05 U1.25
N$23
  Bottom 0.152: UC.3 19.05,57 18.59,57 18.44,56.84 18.44,53.03 20.57,50.9 RC4.1
N$24
  Top 0.152: JP13.2 26.5,71.25 25,71.25 25,70.75 U1.P$39 24.75,70.75 24,70.75 U1.39
N$25
  Bottom 0.152: RC1.1 26.82,62.33 26.82,64.01 JP10.2 26.67,64.01 22.4,64.01 21.64,63.25 19.66,63.25 19.05,62.64 RC6.1 18.9,62.48 18.9,60.05 16.46,57.61 16,57.61 UC.7
N$26
  Bottom 0.152: RC2.1 26.82,54.25 26.82,56.08 JP9.2 26.67,56.24 26.06,56.24 24.99,57.3 24.99,58.22 23.77,59.44 23.32,59.44 21.03,61.72 | 21.03,61.72 21.34,62.03 21.34,62.48 RC7.1 | 21.03,61.72 16.46,57.15 16,57.15 UC.6
N$27  (via drill 0.35)
  Top 0.152: v17.37,51.82 v17.37,56.24
  Bottom 0.152: v17.37,56.24 18.59,57.45 19.05,57.45 UC.2 | v17.37,51.82 17.37,51.21 17.68,50.9 RC3.1
N$29  (via drill 0.35)
  Top 0.152: v27.74,42.37 27.74,39.93 25.45,37.64 24.99,37.64 U1.P$26 24.84,37.64 23.93,37.64 U1.26
  Bottom 0.152: v27.74,42.37 27.74,43.43 27.28,43.89 26.82,43.89 JP12.1 | RD3.2 17.83,28.5 18.59,28.5 19.51,29.41 21.34,29.41 22.86,30.94 22.86,36.58 23.77,37.49 U1.26
N$30
  Top 0.152: U1.27 23.93,40.08 24.84,40.08 U1.P$27
  Bottom 0.152: 26.06,35.81 25.45,35.2 25.45,32.61 24.23,31.39 23.77,31.39 21.49,29.11 21.34,29.11 20.73,28.5 RD4.2 | 26.06,35.81 26.67,35.81 JP11.1 | 26.06,35.81 25.45,36.42 25.45,37.95 23.93,39.47 23.93,40.08 U1.27
N$33  (via drill 0.35)
  Top 0.152: v15.54,41.76 15.54,44.5 v16.76,45.72 23.77,52.73 U1.P$32 23.93,52.73 U1.32
  Bottom 0.152: v15.54,41.76 15.24,41.45 15.24,36.12 15.39,35.97 15.85,35.97 UD.5 | v16.76,45.72 16.76,43.43 RD5.2
N$36
  Bottom 0.152: RD1.1 26.82,41.3 26.82,43.13 JP12.2 26.67,43.28 24.69,43.28 24.23,43.74 23.01,43.74 21.64,42.37 19.66,42.37 19.05,41.76 RD6.1 18.9,41.6 18.9,39.17 16.61,36.88 16,36.88 UD.7
N$37  (via drill 0.35)
  Top 0.152: v20.12,41.6 19.51,41.6 16.15,38.25 16.15,36.88 v16.92,36.12
  Bottom 0.152: 16.76,35.97 16.92,35.81 16.92,25.91 19.96,22.86 25.15,22.86 25.45,23.16 25.45,31.85 26.67,33.07 RD2.1 26.82,33.22 26.82,35.05 JP11.2 | 16.76,35.97 16.46,36.27 16,36.27 UD.6 | v20.12,41.6 21.34,41.6 RD7.1 | 16.76,35.97 v16.92,36.12

### Text on the board
tPlace: GND | FAN | BAT | LED | 3.3V | 5V | C1 | 5V | GND | 5V | GND | 5V | GND | 5V | GND | A | B | A | B | A | B | A | B | A | B | C | D | MIT License / https://github.com/OrangeFox86/DreamPicoPort
bPlace: Rev 1.2